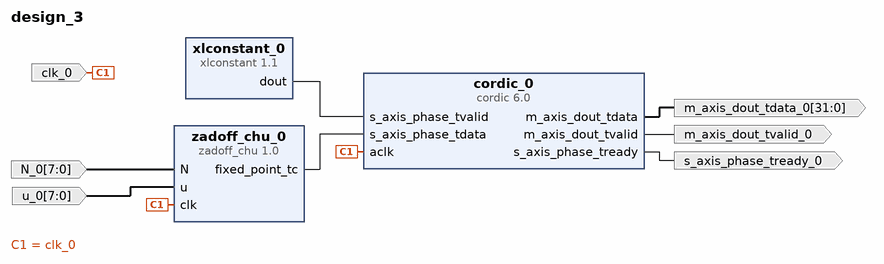
[diagram p0: block diagram of the top level]
# Vivado block design design_3, xczu7ev-ffvc1156-2-e, Vivado 2022.2
create_bd_design design_3

create_bd_port -dir I -type clk clk_0
create_bd_port -dir I -from 7 -to 0 u_0
create_bd_port -dir I -from 7 -to 0 N_0
create_bd_port -dir O -from 31 -to 0 m_axis_dout_tdata_0
create_bd_port -dir O m_axis_dout_tvalid_0
create_bd_port -dir O s_axis_phase_tready_0

create_bd_cell -type ip -vlnv xilinx.com:ip:cordic:6.0 cordic_0
set_property -dict [list \
  CONFIG.Data_Format SignedFraction \
  CONFIG.Functional_Selection Sin_and_Cos \
  CONFIG.Input_Width 10 \
  CONFIG.Output_Width 10 \
  CONFIG.flow_control Blocking \
  CONFIG.out_tlast_behv Null \
  CONFIG.phase_has_tlast false \
] [get_bd_cells cordic_0]
create_bd_cell -type ip -vlnv xilinx.com:ip:xlconstant:1.1 xlconstant_0
create_bd_cell -type ip -vlnv xilinx.com:user:zadoff_chu:1.0 zadoff_chu_0

# ---- connections ----

connect_bd_net -net N_0_1 [get_bd_ports N_0] [get_bd_pins zadoff_chu_0/N]
connect_bd_net -net clk_0_1 [get_bd_ports clk_0] [get_bd_pins cordic_0/aclk] [get_bd_pins zadoff_chu_0/clk]
connect_bd_net [get_bd_pins cordic_0/m_axis_dout_tdata] [get_bd_ports m_axis_dout_tdata_0]
connect_bd_net [get_bd_pins cordic_0/m_axis_dout_tvalid] [get_bd_ports m_axis_dout_tvalid_0]
connect_bd_net [get_bd_pins cordic_0/s_axis_phase_tready] [get_bd_ports s_axis_phase_tready_0]
connect_bd_net -net u_0_1 [get_bd_ports u_0] [get_bd_pins zadoff_chu_0/u]
connect_bd_net [get_bd_pins xlconstant_0/dout] [get_bd_pins cordic_0/s_axis_phase_tvalid]
connect_bd_net -net zadoff_chu_0_angle [get_bd_pins zadoff_chu_0/fixed_point_tc] [get_bd_pins cordic_0/s_axis_phase_tdata]

validate_bd_design
save_bd_design
